# Altium schematic sheet Microcontroller.SchDoc
size A; DocumentNumber: 2; SheetNumber: 2; SheetTotal: 5
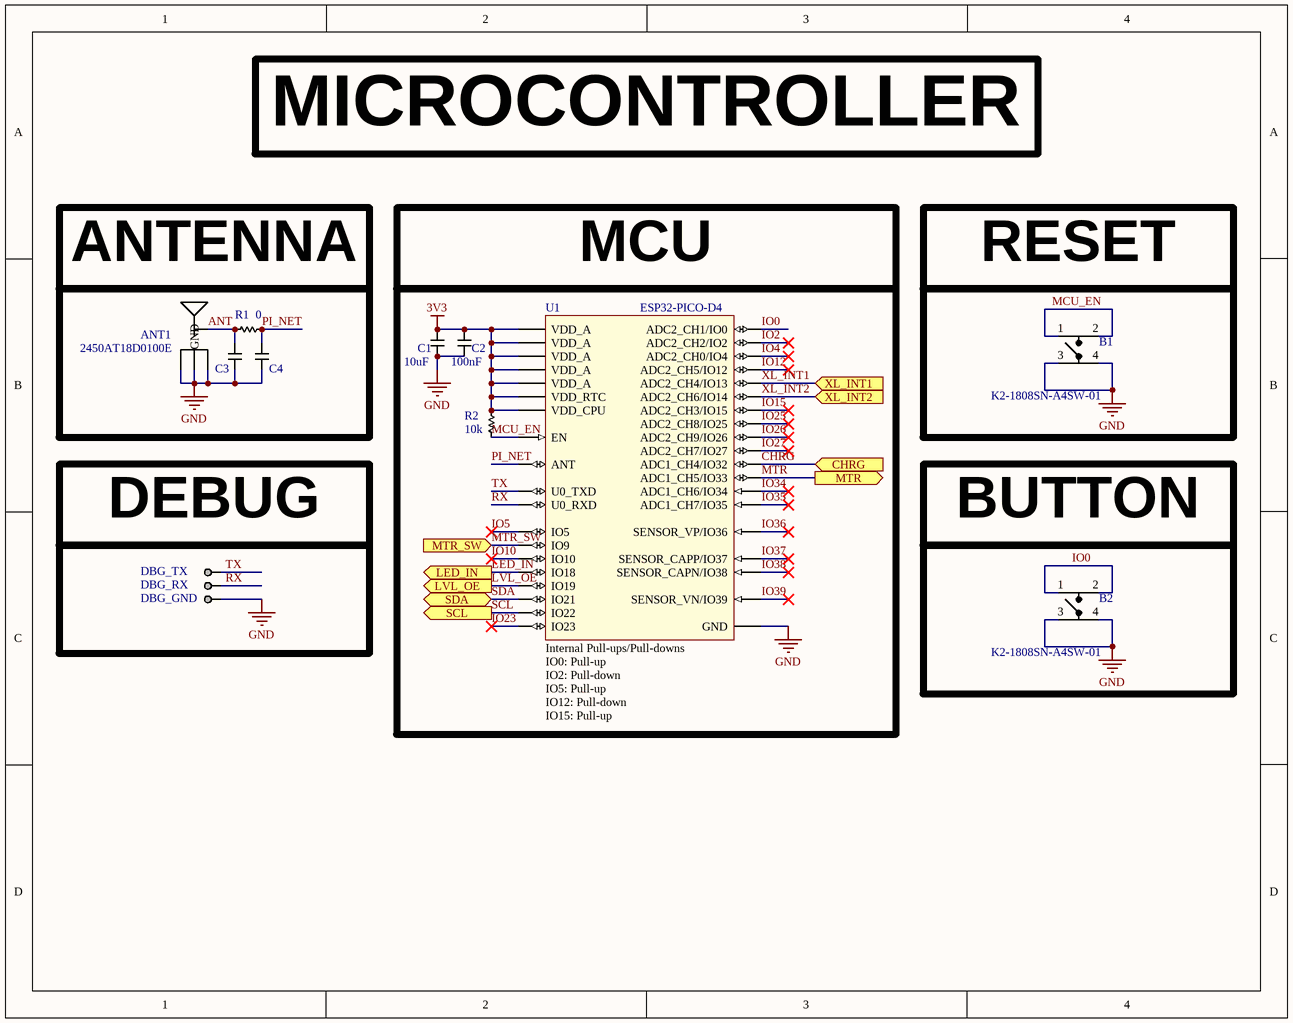
[diagram p0: Microcontroller.SchDoc]

## Parts
ANT1  2450AT18D0100E  [2450AT18D0100E_RH]
B1  K2-1808SN-A4SW-01  [K2-1808SN-A4SW-01]
B2  K2-1808SN-A4SW-01  [K2-1808SN-A4SW-01]
C1  10uF  [CAP_0603_HIGH]
C2  100nF  [CAP_0402_HIGH]
C3  C  [CAP_0402_HIGH]  (value not drawn)  (no BOM)
C4  C  [CAP_0402_HIGH]  (value not drawn)  (no BOM)
DBG_GND  0.1" Header  [0.1" Header]  (value not drawn)  (no BOM)
DBG_RX  0.1" Header  [0.1" Header]  (value not drawn)  (no BOM)
DBG_TX  0.1" Header  [0.1" Header]  (value not drawn)  (no BOM)
R1  0  [RES_0402_HIGH]
R2  10k  [RES_0402_HIGH]
U1  ESP32-PICO-D4  [ESP32-PICO-D4]

## Ports
CHRG (in), LED_IN (out), LVL_OE (out), MTR (out), MTR_SW (in), SCL (out), SDA, XL_INT1 (in), XL_INT2 (in)

## Nets
3V3: C1.2 C2.2 R2.2 U1.1(VDD_A) U1.3(VDD_A) U1.4(VDD_A) U1.19(VDD_RTC) U1.37(VDD_CPU) U1.43(VDD_A) U1.46(VDD_A)
GND: ANT1.2(GND) ANT1.3(GND) ANT1.4(GND) B1.3 B1.4 B2.3 B2.4 C1.1 C2.1 C3.1 C4.1 DBG_GND.1 U1.49(GND)
ANT: ANT1.1(FEED) C3.2 R1.1
CHRG: U1.12(ADC1_CH4/IO32) ; port CHRG
IO0: B2.1 B2.2 U1.23(ADC2_CH1/IO0)
IO2: U1.22(ADC2_CH2/IO2)
IO4: U1.24(ADC2_CH0/IO4)
IO5: U1.34(IO5)
IO10: U1.29(IO10)
IO12: U1.18(ADC2_CH5/IO12)
IO15: U1.21(ADC2_CH3/IO15)
IO23: U1.36(IO23)
IO25: U1.14(ADC2_CH8/IO25)
IO26: U1.15(ADC2_CH9/IO26)
IO27: U1.16(ADC2_CH7/IO27)
IO34: U1.10(ADC1_CH6/IO34)
IO35: U1.11(ADC1_CH7/IO35)
IO36: U1.5(SENSOR_VP/IO36)
IO37: U1.6(SENSOR_CAPP/IO37)
IO38: U1.7(SENSOR_CAPN/IO38)
IO39: U1.8(SENSOR_VN/IO39)
LED_IN: U1.35(IO18) ; port LED_IN
LVL_OE: U1.38(IO19) ; port LVL_OE
MCU_EN: B1.1 B1.2 R2.1 U1.9(EN)
MTR: U1.13(ADC1_CH5/IO33) ; port MTR
MTR_SW: U1.28(IO9) ; port MTR_SW
PI_NET: C4.2 R1.2 U1.2(ANT)
RX: DBG_RX.1 U1.40(U0_RXD)
SCL: U1.39(IO22) ; port SCL
SDA: U1.42(IO21) ; port SDA
TX: DBG_TX.1 U1.41(U0_TXD)
XL_INT1: U1.20(ADC2_CH4/IO13) ; port XL_INT1
XL_INT2: U1.17(ADC2_CH6/IO14) ; port XL_INT2

## Notes on the sheet
- MICROCONTROLLER
- ANTENNA
- MCU
- (near B1) RESET
- DEBUG
- (near B2) BUTTON
- (in symbol ESP32-PICO-D4) Internal Pull-ups/Pull-downs / IO0: Pull-up / IO2: Pull-down / IO5: Pull-up / IO12: Pull-down / IO15: Pull-up /

## Library data of the parts
ANT1 = 2450AT18D0100E_RH: 2450AT18D0100E 2.4GHz  Chip RF Antenna 2.4GHz ~ 2.5GHz 1.5dBi Solder Surface Mount
B1 B2 = K2-1808SN-A4SW-01: K2-1808SN-A4SW-01 Tactile Switch SPST-NO Top Actuated Surface Mount
C1 = Capacitor_0603: 0603 Capacitor
C2-C4 = Capacitor_0402: 0402 Capacitor
R1 R2 = Resistor_0402: 0402 Resistor
U1 = ESP32-PICO-D4: ESP32-PICO-D4 SoC